# EAGLE design ValpoHat-v002 (EAGLE 6.5.0)
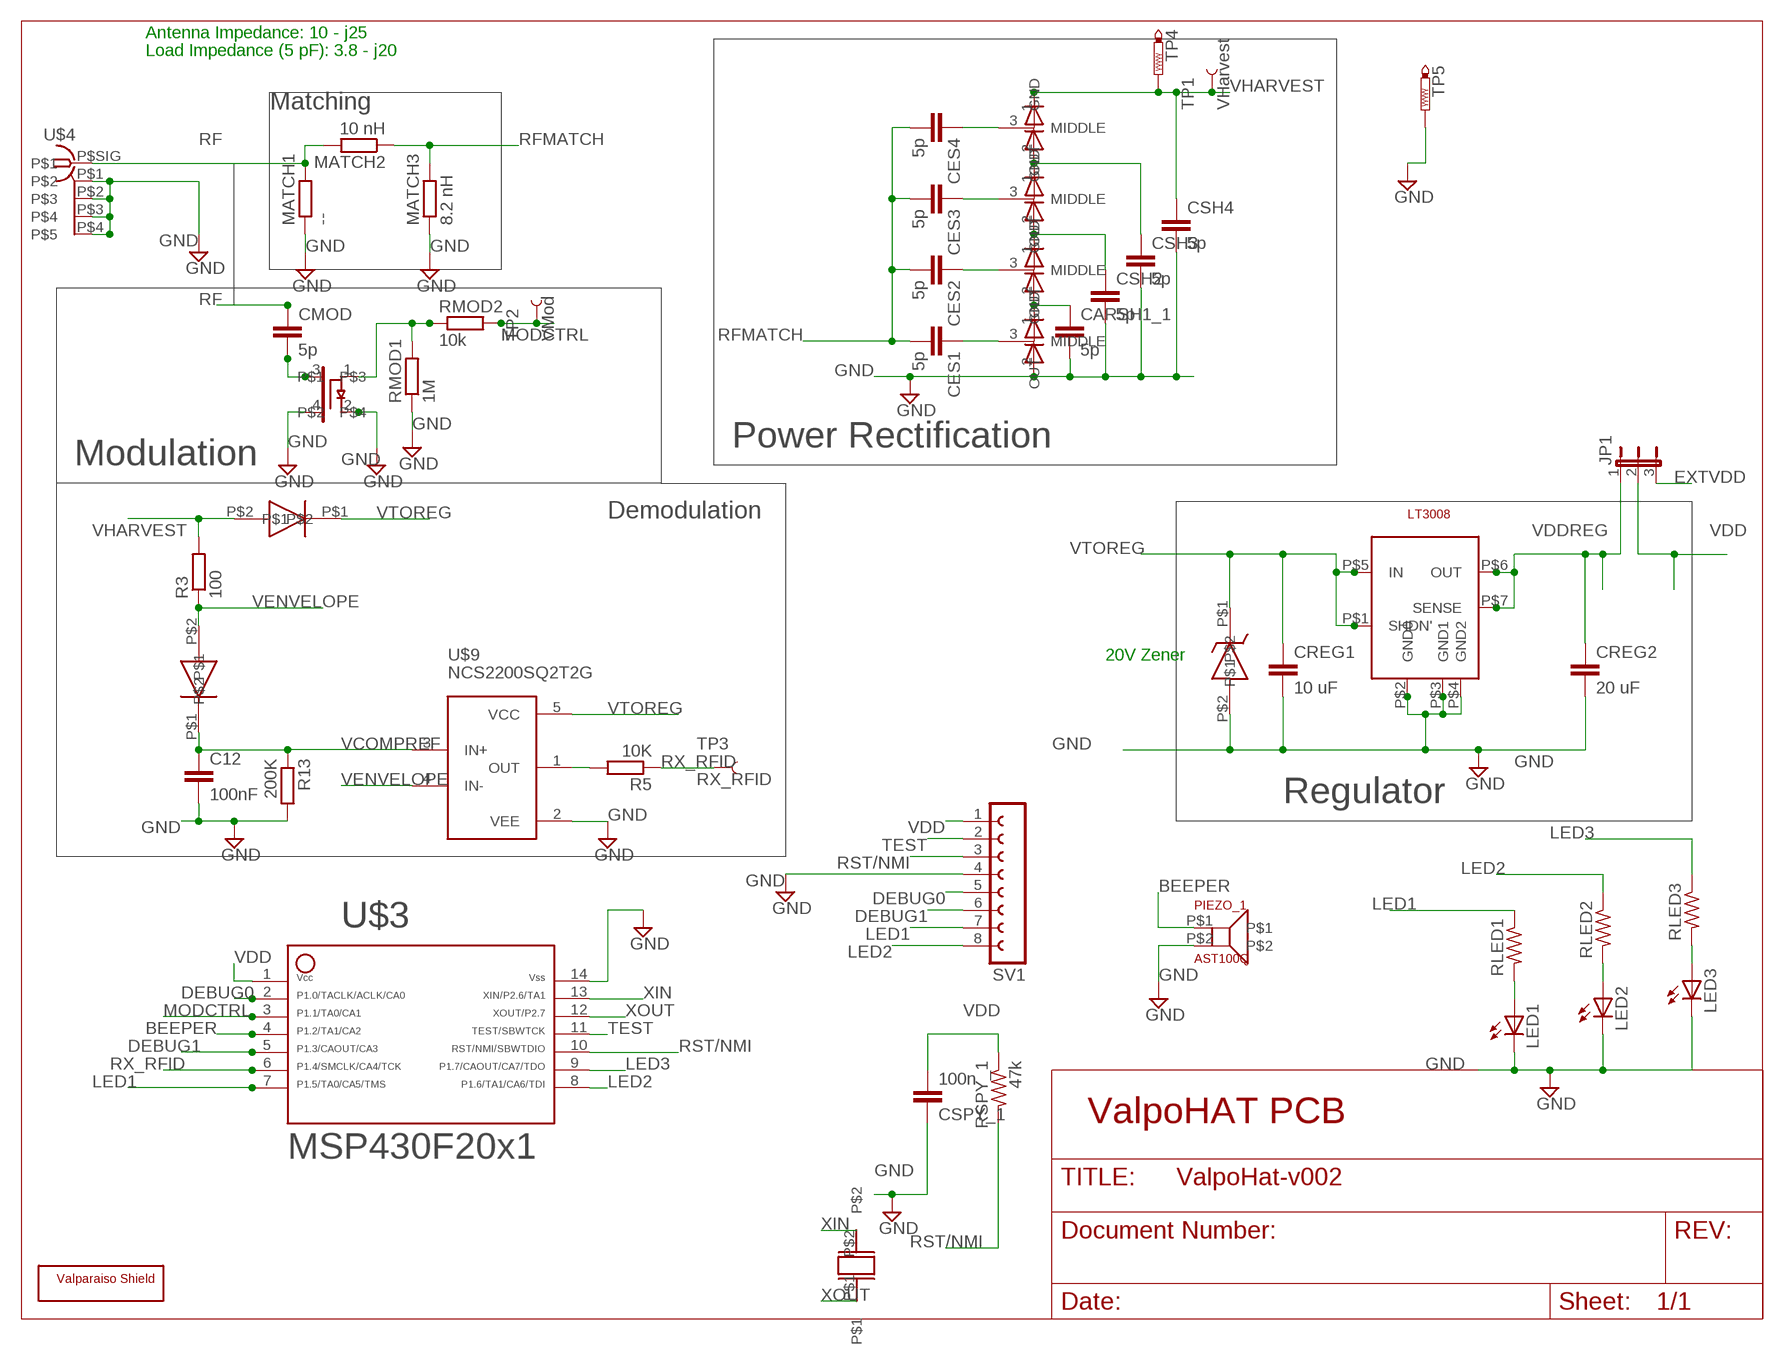
[diagram p0: schematic, sheet 1]

## Parts
C12  100nF  C-EUC1206  [C1206]
CARSH1_1  5p  C-EUC0603  [C0603]
CES1  5p  C-EUC0603  [C0603]
CES2  5p  C-EUC0603  [C0603]
CES3  5p  C-EUC0603  [C0603]
CES4  5p  C-EUC0603  [C0603]
CMOD  5p  C-EUC0603  [C0603]
CREG1  10 uF  C-EUC1206  [C1206]
CREG2  20 uF  C-EUC1206  [C1206]
CSH2  5p  C-EUC0603  [C0603]
CSH3  5p  C-EUC0603  [C0603]
CSH4  5p  C-EUC0603  [C0603]
CSPY_1  100n  C-EUC1206  [C1206]
D1  RB751S40T1_EXPAND  [SOD-523_EXPAND]
D2  RB751S40T1_EXPAND  [SOD-523_EXPAND]
JP1  JP2E  [JP2]
LED1  LEDCHIP-LED0603  [CHIP-LED0603]
LED2  LEDCHIP-LED0603  [CHIP-LED0603]
LED3  LEDCHIP-LED0603  [CHIP-LED0603]
MATCH1  --  R-EU_R0603  [R0603]
MATCH2  10 nH  R-EU_R0603  [R0603]
MATCH3  8.2 nH  R-EU_R0603  [R0603]
PIEZO_1  AST100Q  [AST100Q]
R3  100  R-EU_R1206  [R1206]
R5  10K  R-EU_R1206  [R1206]
R13  200K  R-EU_R1206  [R1206]
RLED1  R-US_R1206  [R1206]
RLED2  R-US_R1206  [R1206]
RLED3  R-US_R1206  [R1206]
RMOD1  1M  R-EU_R1206  [R1206]
RMOD2  10k  R-EU_R1206  [R1206]
RSPY_1  47k  R-US_R1206  [R1206]
SV1  FE08-1  [FE08]
TP1  VHarvest  TEST-POINT3  [PAD.03X.03]
TP2  VMod  TEST-POINT3  [PAD.03X.03]
TP3  RX_RFID  TEST-POINT3  [PAD.03X.03]
TP4  TESTPAD_PTR1PAD1-13  [TESTPAD_P1-13]
TP5  TESTPAD_PTR1PAD1-13  [TESTPAD_P1-13]
U$1  BF1108R  [SOT-143R]
U$2  MMSZ4707T1  [SOD-123]
U$3  F20X1---N14  [N14]
U$4  SMA_EDGE_CONN_ALT  [SMA_EDGE_2SIDE]
U$5  HSMS2852  [SOT23]
U$6  HSMS2852  [SOT23]
U$7  HSMS2852  [SOT23]
U$8  HSMS2852  [SOT23]
U$9  NCS2200SQ2T2G  [SC70-5]
U$10  LT3008-TSOT  [TSOT-23]
U$11  VALPARAISO-SHIELD  [VUSHIELD-200MIL]
UCRY_1  ECX31-BSOLDERABLE  [ECX31-B_EXPAND]

## Nets
BEEPER: PIEZO_1.P$1 U$3.4
DEBUG0: SV1.5 U$3.2
DEBUG1: SV1.6 U$3.5
EXTVDD: JP1.3
GND: C12.2 CARSH1_1.2 CREG1.2 CREG2.2 CSH2.2 CSH3.2 CSH4.2 CSPY_1.1 LED1.C LED2.C LED3.C MATCH1.1 MATCH3.1 PIEZO_1.P$2 R13.2 RMOD1.1 SV1.4 TP5.TP U$1.2 U$1.4 U$2.P$2 U$3.14 U$4.P$1 U$4.P$2 U$4.P$3 U$4.P$4 U$5.2(GND) U$9.2(VEE) U$10.P$2(GND0) U$10.P$3(GND1) U$10.P$4(GND2)
LED1: RLED1.1 SV1.7 U$3.7
LED2: RLED2.1 SV1.8 U$3.8
LED3: RLED3.1 U$3.9
MODCTRL: RMOD2.2 TP2.P$1 U$3.3
N$1: CMOD.2 U$1.3
N$2: RMOD1.2 RMOD2.1 U$1.1
N$3: LED3.A RLED3.2
N$5: CARSH1_1.1 U$5.1(OUT) U$6.2(GND)
N$6: LED1.A RLED1.2
N$7: LED2.A RLED2.2
N$8: CES2.1 U$6.3(MIDDLE)
N$9: CES1.1 U$5.3(MIDDLE)
N$10: R5.2 U$9.1(OUT)
N$11: CSH2.1 U$6.1(OUT) U$7.2(GND)
N$16: CSH3.1 U$7.1(OUT) U$8.2(GND)
N$27: CES4.1 U$8.3(MIDDLE)
N$32: CES3.1 U$7.3(MIDDLE)
RF: CMOD.1 MATCH1.2 MATCH2.2 U$4.P$SIG
RFMATCH: CES1.2 CES2.2 CES3.2 CES4.2 MATCH2.1 MATCH3.2
RST/NMI: RSPY_1.2 SV1.3 U$3.10
RX_RFID: R5.1 TP3.P$1 U$3.6
TEST: SV1.2 U$3.11
VCOMPREF: C12.1 D2.P$1 R13.1 U$9.3(IN+)
VDD: CSPY_1.2 JP1.2 RSPY_1.1 SV1.1 U$3.1
VDDREG: CREG2.1 JP1.1 U$10.P$6(OUT) U$10.P$7(SENSE)
VENVELOPE: D2.P$2 R3.1 U$9.4(IN-)
VHARVEST: CSH4.1 D1.P$2 R3.2 TP1.P$1 TP4.TP U$8.1(OUT)
VTOREG: CREG1.1 D1.P$1 U$2.P$1 U$9.5(VCC) U$10.P$1(SHDN') U$10.P$5(IN)
XIN: U$3.13 UCRY_1.P$2
XOUT: U$3.12 UCRY_1.P$1

## Notes on the sheet
- Antenna Impedance: 10 - j25
- Load Impedance (5 pF): 3.8 - j20
- Matching
- Power Rectification
- Modulation
- Demodulation
- 20V Zener
- Regulator
- ValpoHAT PCB

## Library data of the parts
C12 CARSH1_1 CES1-CES4 CMOD CREG1 CREG2 CSH2-CSH4 CSPY_1 = rcl:C-EU: CAPACITOR, European symbol
D1 D2 = RB751s40t1:RB751S40T1_EXPAND
JP1 = jumper:JP2E: JUMPER
LED1-LED3 = led:LED: LED OSRAM: - CHIPLED LG R971, LG N971, LY N971, LG Q971, LY Q971, LO R971, LY R971 LH N974, LH R974 LS Q976, LO Q976, LY Q976 LO Q996 - Hyper CHIPLED LW Q18S LB Q993, LB Q99A, LB R99A - SideLED LS A670, LO A670, LY A670, LG A670, LP A670 LB A673, LV A673, LT A673, LW A673 LH A674 LY A675 LS A676, LA A676, LO A676, LY A676, LW A676 LS A679, LY A679, LG A679 - Hyper Micro SIDELED® LS Y876, LA Y876, LO Y876, LY Y876 LT Y87S - SmartLED LW L88C, LW L88S LB L89C, LB L89S, LG L890 LS L89K, LO L89K, LY L89K LS L896, LA L896, LO L896, LY L896 - TOPLED LS T670, LO T670, LY T670, LG T670, LP T670 LSG T670, LSP T670, LSY T670, LOP T670, LYG T670 LG T671, LOG T671, LSG T671 LB T673, LV T673, LT T673, LW T673 LH T674 LS T676, LA T676, LO T676, LY T676, LB T676, LH T676, LSB T676, LW T676 LB T67C, LV T67C, LT T67C, LS T67K, LO T67K, LY T67K, LW E67C LS E67B, LA E67B, LO E67B, LY E67B, LB E67C, LV E67C, LT E67C LW T67C LS T679, LY T679, LG T679 LS T770, LO T770, LY T770, LG T770, LP T770 LB T773, LV T773, LT T773, LW T773 LH T774 LS E675, LA E675, LY E675, LS T675 LS T776, LA T776, LO T776, LY T776, LB T776 LHGB T686 LT T68C, LB T68C - Hyper Mini TOPLED® LB M676 - Mini TOPLED Santana® LG M470 LS M47K, LO M47K, LY M47K Source: http://www.osram.convergy.de LUXEON: - LUMILED® LXK2-PW12-R00, LXK2-PW12-S00, LXK2-PW14-U00, LXK2-PW14-V00 LXK2-PM12-R00, LXK2-PM12-S00, LXK2-PM14-U00 LXK2-PE12-Q00, LXK2-PE12-R00, LXK2-PE12-S00, LXK2-PE14-T00, LXK2-PE14-U00 LXK2-PB12-K00, LXK2-PB12-L00, LXK2-PB12-M00, LXK2-PB14-N00, LXK2-PB14-P00, LXK2-PB14-Q00 LXK2-PR12-L00, LXK2-PR12-M00, LXK2-PR14-Q00, LXK2-PR14-R00 LXK2-PD12-Q00, LXK2-PD12-R00, LXK2-PD12-S00 LXK2-PH12-R00, LXK2-PH12-S00 LXK2-PL12-P00, LXK2-PL12-Q00, LXK2-PL12-R00 Source: www.luxeon.com KINGBRIGHT: KA-3528ASYC Source: www.kingbright.com
MATCH1-MATCH3 R3 R5 R13 RMOD1 RMOD2 = rcl:R-EU_: RESISTOR, European symbol
PIEZO_1 = ast100q_Piezo:AST100Q
RLED1-RLED3 RSPY_1 = rcl:R-US_: RESISTOR, American symbol
SV1 = con-lsta:FE08-1: FEMALE HEADER; OC_FARNELL: unknown; OC_NEWARK: unknown
TP1-TP3 = SparkFun:TEST-POINT
TP4 TP5 = GeigerCounter:TESTPAD_PTR1: TEST PIN
U$1 = BF1108R:BF1108R
U$2 = OnSemi:MMSZ4707T1
U$3 = TI_MSP430_v13:F20X1---N14: ***MSP430F20x1***N14
U$4 = SMAConnections:SMA_EDGE_CONN_ALT
U$5-U$8 = Diode:HSMS2852
U$9 = NCS2200:NCS2200SQ2T2G
U$10 = LT3008:LT3008-TSOT
U$11 = VUShield:VALPARAISO-SHIELD
UCRY_1 = ECX-31b:ECX31-B

## Board
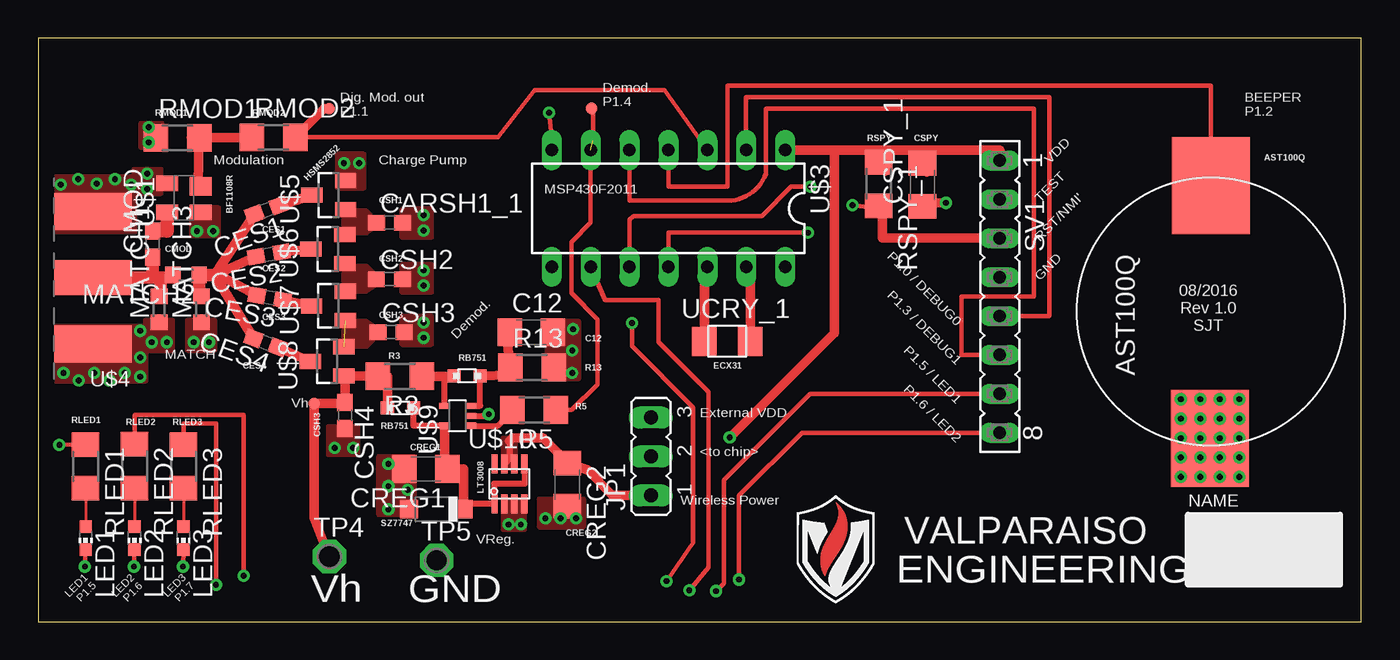
[diagram p1: board, top side]
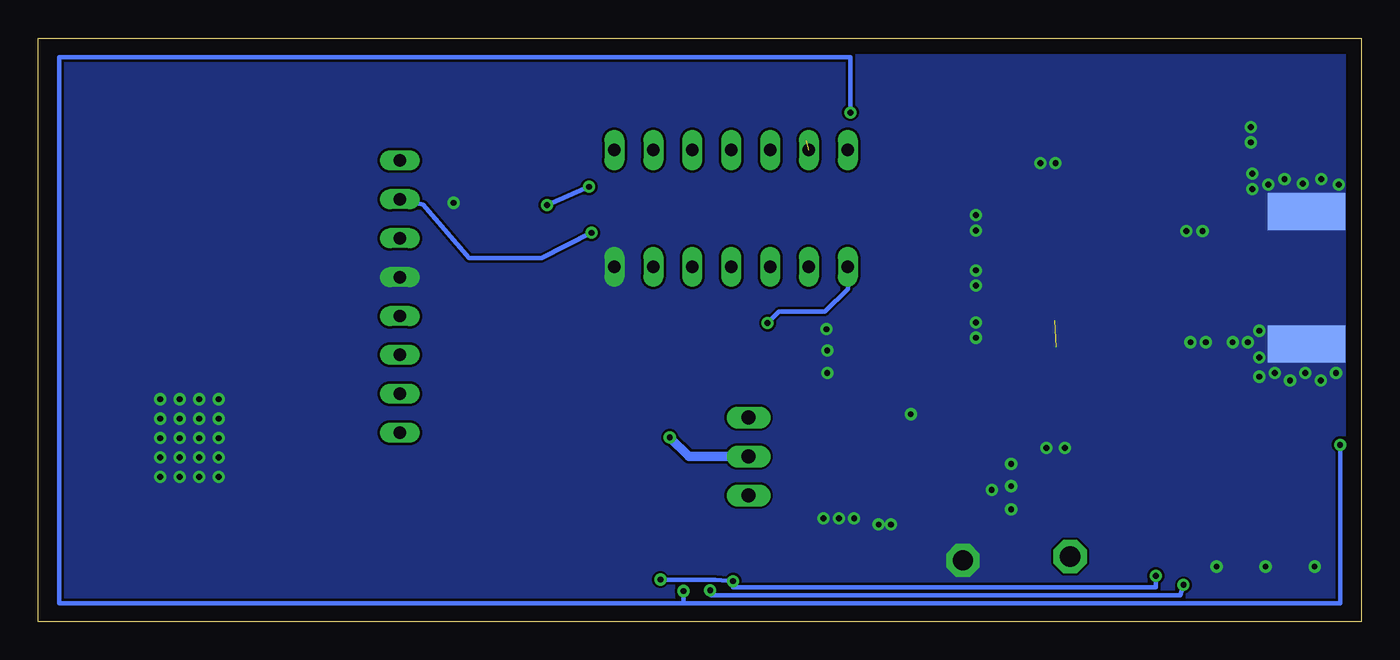
[diagram p2: board, bottom side, seen from below]

Size 86.36 x 38.1 mm. Coordinates in mm from the lower left corner, seen from the top.
Outline: 0,0 86.36,0 86.36,38.1 0,38.1 0,0
Copper layers (1*16): Top 0.035mm / dielectric 1.5mm / Bottom 0.035mm
Design rules "AdvancedCircuitsBarebones *": minimum track width 6mil, minimum drill 15mil, track to track 6mil, track to pad 6mil, pad to pad 6mil, via to via 6mil, smd to smd 0mil, copper to edge 40mil, drill to drill 6mil, minimum pad ring 10mil, minimum via ring 8mil, stop-mask expansion 4mil, vias tented up to drill 15mil, thermal gap 10mil

### Footprints (pad centres in the part's own frame; a part is rotated, then mirrored left to right if it is on the bottom)
C1206 = smd 1.6 x 1.8: 1 -1.4,0; 2 1.4,0
C0603 = smd 1.1 x 1: 1 -0.85,0; 2 0.85,0
SOD-523_EXPAND = smd 0.85 x 0.85: P$1 -0.85,0; P$2 0.85,0
JP2 = drill 0.914 long: 1 -2.54,0; 2 0,0; 3 2.54,0
CHIP-LED0603 = smd 0.8 x 0.8: A 0,-0.75; C 0,0.75
R0603 = smd 1 x 1.1: 1 -0.85,0; 2 0.85,0
AST100Q = smd 6.35 x 5.08: P$1 -1.27,0; P$2 15.24,-0.07
R1206 = smd 1.6 x 1.803: 1 -1.422,0; 2 1.422,0
FE08 = drill 0.813 long: 1 -8.89,0; 2 -6.35,0; 3 -3.81,0; 4 -1.27,0; 5 1.27,0; 6 3.81,0; 7 6.35,0; 8 8.89,0
PAD.03X.03 = smd 0.762 x 0.762: P$1 0,0
TESTPAD_P1-13 = drill 1.321 pad 2.159 octagon: TP 0,0
SOT-143R = smd 1.2 x 1.44: 1 0.75,-1.1 | smd 1 x 1.44: 2 -0.95,-1.1; 3 -0.95,1.1; 4 0.95,1.1
SOD-123 = smd 1.2 x 1.22: P$1 -1.78,0; P$2 1.78,0
N14 = drill 0.813 long: 1 -7.625,-3.81; 2 -5.085,-3.81; 3 -2.545,-3.81; 4 -0.005,-3.81; 5 2.535,-3.81; 6 5.075,-3.81; 7 7.615,-3.81; 8 7.615,3.81; 9 5.075,3.81; 10 2.535,3.81; 11 -0.005,3.81; 12 -2.545,3.81; 13 -5.085,3.81; 14 -7.625,3.81
SMA_EDGE_2SIDE = smd 2.413 x 5.08: P$1 -4.318,-2.54; P$2 4.318,-2.54 | smd 2.413 x 5.08 bottom: P$3 -4.318,-2.54; P$4 4.318,-2.54 | smd 2.286 x 5.08: P$SIG 0,-2.54
SOT23 = smd 1 x 1.4: 1 -0.95,-1.1; 2 0.95,-1.1; 3 0,1.1
SC70-5 = smd 0.4 x 0.7: 1 -0.65,-0.85; 2 0,-0.85; 3 0.65,-0.85; 4 0.65,0.85; 5 -0.65,0.85
TSOT-23 = smd 0.4 x 1.22: P$1 -0.975,-1.31; P$2 -0.325,-1.31; P$3 0.325,-1.31; P$4 0.975,-1.31; P$5 0.975,1.31; P$6 0.325,1.31; P$7 -0.325,1.31; P$8 -0.975,1.31
ECX31-B_EXPAND = smd 1.6 x 1.9: P$1 -1.5,0; P$2 1.5,0

### Placement (x,y rotation side)
C12  32.17,18.9 0 top
CARSH1_1  22.94,26.05 0 top
CES1  14.91,26.89 200 top
CES2  15.05,23.99 190 top
CES3  15.11,21.17 170 top
CES4  14.85,18.21 160 top
CMOD  7.47,24.66 90 top
CREG1  25.31,9.98 180 top
CREG2  34.53,8.95 270 top
CSH2  22.92,22.37 0 top
CSH3  23.04,18.9 0 top
CSH4  20.02,13.47 270 top
CSPY_1  57.72,28.52 90 top
D1  23.64,13.96 180 top
D2  27.99,16.06 180 top
JP1  39.99,10.79 90 top
LED1  3.09,5.46 180 top
LED2  6.28,5.46 180 top
LED3  9.48,5.46 180 top
MATCH1  7.9,20.4 90 top
MATCH2  9.65,22.65 180 top
MATCH3  10.65,20.4 90 top
PIEZO_1  76.54,27.2 270 top
R3  23.6,16.03 180 top
R5  32.38,13.83 180 top
R13  32.23,16.6 0 top
RLED1  3.09,10.14 270 top
RLED2  6.28,10.16 270 top
RLED3  9.48,10.13 270 top
RMOD1  9.1,31.59 0 top
RMOD2  15.36,31.63 0 top
RSPY_1  54.86,28.58 270 top
SV1  62.77,21.23 270 top
TP1  18,14.25 0 top
TP2  19,33.5 0 top
TP3  36.12,33.52 0 top
TP4  19,4.25 0 top
TP5  26,4 0 top
U$1  9.51,27.68 90 top
U$2  25.98,7.35 180 top
U$3  41.13,26.99 180 top
U$4  1.02,22.47 90 top
U$5  18.96,27.86 90 top
U$6  18.9,24.34 90 top
U$7  18.94,20.62 90 top
U$8  18.85,17 90 top
U$9  27.37,13.45 90 top
U$10  30.75,9 0 top
U$11  52.07,4.45 0 top
UCRY_1  44.98,18.31 0 top

### Tracks (layer width: path | path; a pad name or v marks a point on that pad's centre or on a via)
BEEPER
  Top 0.305: U$3.4 41.13,28.4 45,28.4 45,35 76.54,35 PIEZO_1.P$1
DEBUG0
  Top 0.305: U$3.2 46.21,34.25 66,34.25 66,19.96 SV1.5
DEBUG1
  Top 0.305: U$3.5 38.59,27.5 45,27.5 arc70 47.5,29.25 47.5,33.5 65,33.5 65,21.25 60.25,21.25 60.25,17.42 SV1.6
GND  (via drill 0.38)
  Top 0.178: PIEZO_1.P$2 arc90 76.44,11.99 v75.85,11.99
  Top 0.305: LED1.C v3.04,3.6 | LED2.C v6.24,3.6 | LED3.C v9.44,3.6
  Top 0.406: U$9.2 29.41,13.45 v29.41,13.55
  Top 0.635: CSPY_1.1 58.26,27.38 v59.26,27.35
  other vias: 74.58,14.53 75.85,14.53 77.12,14.53 78.39,14.53 74.58,13.26 75.85,13.26 77.12,13.26 78.39,13.26 74.58,11.99 77.12,11.99 78.39,11.99 74.58,10.72 75.85,10.72 77.12,10.72 78.39,10.72 74.58,9.45 75.85,9.45 77.12,9.45 78.39,9.45 1.64,16.25 2.64,15.75 3.64,16.25 4.64,15.75 5.64,16.25 6.64,16 6.64,17.25 7.39,18.25 8.39,18.25 10.14,18.25 11.14,18.25 6.64,19 6.06,28.55 5.01,28.9 3.81,28.6 2.61,28.9 1.46,28.55 7.11,29.25 7.11,28.25 10.36,25.5 11.41,25.5 25.15,25.54 25.15,26.54 25.15,21.94 25.15,22.94 25.15,18.54 25.15,19.54 19.95,29.94 20.95,29.94 19.35,11.34 20.55,11.34 34.86,16.25 34.86,17.7 34.91,19.1 22.85,10.31 22.85,8.85 22.85,7.34 30.7,6.34 31.5,6.34 33.1,6.74 34.1,6.74 35.1,6.74 7.21,32.3 7.21,31.3 24.12,8.6
  pour Bottom (no thermals): 0,0 86,0 85.75,37.75 0,37.75
  pour Top (no thermals): 7,17.75 8.75,17.75 8.75,19.65 7,19.65
  pour Top (no thermals): 9.75,17.75 11.5,17.75 11.5,19.65 9.75,19.65
  pour Top (no thermals): 1,15.75 7,15.75 7,19.25 1,19.25
  pour Top (no thermals): 6.3,29 1,29 1,25.5 6.3,25.5
  pour Top (no thermals): 6.25,28 8,28 8,29.5 6.25,29.5
  pour Top (no thermals): 10,25.25 11.75,25.25 11.75,27 10,27
  pour Top (no thermals): 25.65,25.15 25.65,26.9 23.75,26.9 23.75,25.15
  pour Top (no thermals): 25.65,21.55 25.65,23.3 23.75,23.3 23.75,21.55
  pour Top (no thermals): 25.65,18.15 25.65,19.9 23.75,19.9 23.75,18.15
  pour Top (no thermals): 21.25,28.35 21.25,30.5 19.55,30.5 19.55,28.35
  pour Top (no thermals): 20.85,10.95 20.85,12.7 18.95,12.7 18.95,10.95
  pour Top (no thermals): 33.4,15.9 33.15,19.6 35.25,19.6 35.25,15.9
  pour Top (no thermals): 24.5,10.76 24.5,7 22.25,7 22.25,10.76
  pour Top (no thermals): 30.35,8 31.75,8 31.75,6 30.35,6
  pour Top (no thermals): 32.75,8 35.55,8 35.55,6.2 32.75,6.2
  pour Top (no thermals): 8.1,30.95 8.1,32.55 6.7,32.55 6.7,30.95
LED1  (via drill 0.38)
  Top 0.203: RLED1.1 3.02,11.39
  Top 0.305: RLED1.1 1.45,11.56 v1.38,11.55 | v33.35,33.25 33.6,30.8 U$3.7 | SV1.7 50.38,14.88 44.75,9.25 44.75,2.5 v44.25,2
  Bottom 0.305: v1.38,11.55 1.38,1.2 44.25,1.2 | 44.25,1.2 85,1.2 85,36.87 33.35,36.87 v33.35,33.25 | v44.25,2 44.25,1.2
LED2  (via drill 0.38)
  Top 0.305: RLED2.1 6.28,13.5 13.4,13.5 v13.4,3 | v41,2.65 42.75,5.15 42.75,14 38.75,18 v38.75,19.5 | SV1.8 49.84,12.34 45.75,8.25 v45.75,2.75
  Bottom 0.305: v38.75,19.5 38,20.25 35,20.25 33.51,21.74 U$3.8 | v45.75,2.75 42.15,2.75 v41,2.65 41,2.25 13.4,2.25 v13.4,3
LED3  (via drill 0.38)
  Top 0.305: v11.6,2.4 11.6,12.95 9.48,12.95 RLED3.1 | U$3.9 37,21 40.5,21 40.5,18.25 43.75,15 43.75,3.55 v42.5,2.05
  Bottom 0.305: v11.6,2.4 11.8,1.72 42.45,1.72 v42.5,2.05
MODCTRL
  Top 0.305: RMOD2.2 16.73,31.65 30,31.65 32.4,34.7 40.87,34.7 U$3.3
  Top 0.635: TP2.P$1 18.65,33.5 RMOD2.2
N$1
  Top 0.813: CMOD.2 8.41,25.51
  Top 0.889: 8.41,25.51 U$1.3
N$2
  Top 0.635: U$1.1 10.45,28.6 RMOD1.2 9.98,31.63 RMOD2.1
N$3
  Top 0.203: RLED3.2 LED3.A
N$5
  pour Top (no thermals): 20,26.8 21.4,26.8 22,26.2 22,25.8 21.4,25.4 20,25.4
N$6
  Top 0.203: RLED1.2 LED1.A
N$7
  Top 0.203: RLED2.2 LED2.A
N$8
  Top 0.635: CES2.1 U$6.3
N$9
  Top 0.635: CES1.1 U$5.3
N$10
  Top 0.406: U$9.1 30,12.8 R5.2
N$11
  pour Top (no thermals): 20,23.2 21.4,23.2 22,22.6 22,22 21.4,21.6 20,21.6
N$16  (1 unrouted)
  pour Top (no thermals): 20,19.6 21.4,19.6 22,19.2 22,18.6 21.4,18 20,18
N$27
  Top 0.635: CES4.1 U$8.3
N$32
  Top 0.635: CES3.1 U$7.3
RF
  Top 0.406: 8.8,22.47 MATCH2.2 | MATCH1.2 8,21.25
  Top 0.813: U$4.P$SIG 7.47,22.47 | 7.47,22.47 8,22.47 | 8,22.47 8.8,22.47 | 8,21.25 8,22.47 | CMOD.1 7.47,22.47
RFMATCH
  Top 0.406: MATCH3.2 10.5,21.25
  Top 0.635: CES1.2 11.5,22.65 | CES2.2 11.69,22.69 | 11.69,22.69 11.5,22.65 | CES3.2 11.69,22.69 | CES4.2 11.5,22.65
  Top 0.813: 11.5,22.65 MATCH2.1 10.5,21.25
RST/NMI  (via drill 0.38)
  Top 0.305: U$3.10 38.59,26.25 38.84,26.5 47.25,26.5 49.15,28.4 v50.4,28.4 | v53.15,27.2 55.11,26.95
  Top 0.635: SV1.3 55.11,25.04 55.11,26.95 RSPY_1.2
  Bottom 0.305: v50.4,28.4 v53.15,27.2
RX_RFID  (1 unrouted)
  Top 0.305: 36.05,29.75 U$3.6 36.05,26.05 34.8,24.8 34.8,21.45 36.5,19.75 36.5,15.5 34.83,13.83 R5.1 | TP3.P$1 36.2,33.44 36.2,31.4
TEST  (via drill 0.38)
  Top 0.305: U$3.11 41.13,25.4 v50.25,25.4
  Bottom 0.305: v50.25,25.4 53.5,23.75 58.25,23.75 61.25,27.25 SV1.2
VCOMPREF
  Top 0.406: U$9.3 28.84,14.1 D2.P$1
  Top 0.635: C12.1 30.63,18.15 R13.1 30.84,16.1 D2.P$1
VDD  (via drill 0.38)
  Top 0.635: 51.96,30.79 U$3.1 | 51.96,30.79 51.96,18.86 v45.14,12.04 | 51.96,30.79 55.3,30.79 | 55.3,30.79 58,30.79 | 58,30.79 62.77,30.79 SV1.1 | RSPY_1.1 55.3,29.43 55.3,30.79 | CSPY_1.2 58,29.37 58,30.79
  Bottom 0.635: JP1.2 43.89,10.79 v45.14,12.04
VDDREG
  Top 0.406: 30.75,11.8 30.75,10.63 U$10.P$7
  Top 0.635: 30.75,11.8 30.95,12 32.95,12 34.03,10.92 CREG2.1 35.85,9.9 37.5,8.25 JP1.1
  pour Top (no thermals): 30.35,10 30.35,12 31.15,12 31.15,10
VENVELOPE
  Top 0.406: U$9.4 26.52,16.03 26.15,16.03
  Top 0.635: R3.1 26.15,16.03 26.64,16.03 D2.P$2
VHARVEST
  Top 0.635: D1.P$2 22.79,16.03 R3.2 22.75,16.05 U$8.1 20.02,16.05 CSH4.1 19.94,14.25 TP1.P$1 18,6.75 TP4.TP
VTOREG
  Top 0.305: U$9.5 26.52,12.6
  Top 0.406: U$9.5 24.49,12.8 D1.P$1 | U$2.P$1 27.76,7.69 U$10.P$1 29.75,9 31.75,9 U$10.P$5
  Top 0.635: U$2.P$1 27.76,9.98 CREG1.1 26.52,9.47 26.52,12.6
XIN
  Top 0.635: U$3.13 46.48,23.18 UCRY_1.P$2
XOUT
  Top 0.635: U$3.12 43.48,23.18 UCRY_1.P$1

### Text on the board
tPlace: Demod. / P1.4 | RMOD1 | RMOD2 | Dig. Mod. out / P1.1 | BEEPER / P1.2 | RSPY | CSPY | Modulation | Charge Pump | VDD | AST100Q | HSMS2852 | MSP430F2011 | BF1108R | CSH1 | TEST | CES1 | RST/NMI' | CMOD | CES2 | CSH2 | GND | CES3 | CSH3 | P1.0 / DEBUG0 | 08/2016 / Rev 1.0 / SJT | Demod. | C12 | MATCH | CES4 | R3 | RB751 | ECX31 | P1.3 / DEBUG1 | R13 | P1.5 / LED1 | Vh | R5 | RLED1 | RLED2 | RLED3 | RB751 | External VDD | CSH3 | P1.6 / LED2 | CREG1 | <to chip> | LT3008 | Wireless Power | NAME | SZ7747 | CREG2 | VReg. | VALPARAISO | LED1 / P1.5 | LED2 / P1.6 | LED3 / P1.7 | ENGINEERING | Vh | GND
tDocu: Valparaiso Univ. / Wireless Computing